# EAGLE design CC1101-1190EM_Adapter_V1_00 (EAGLE 6.4)
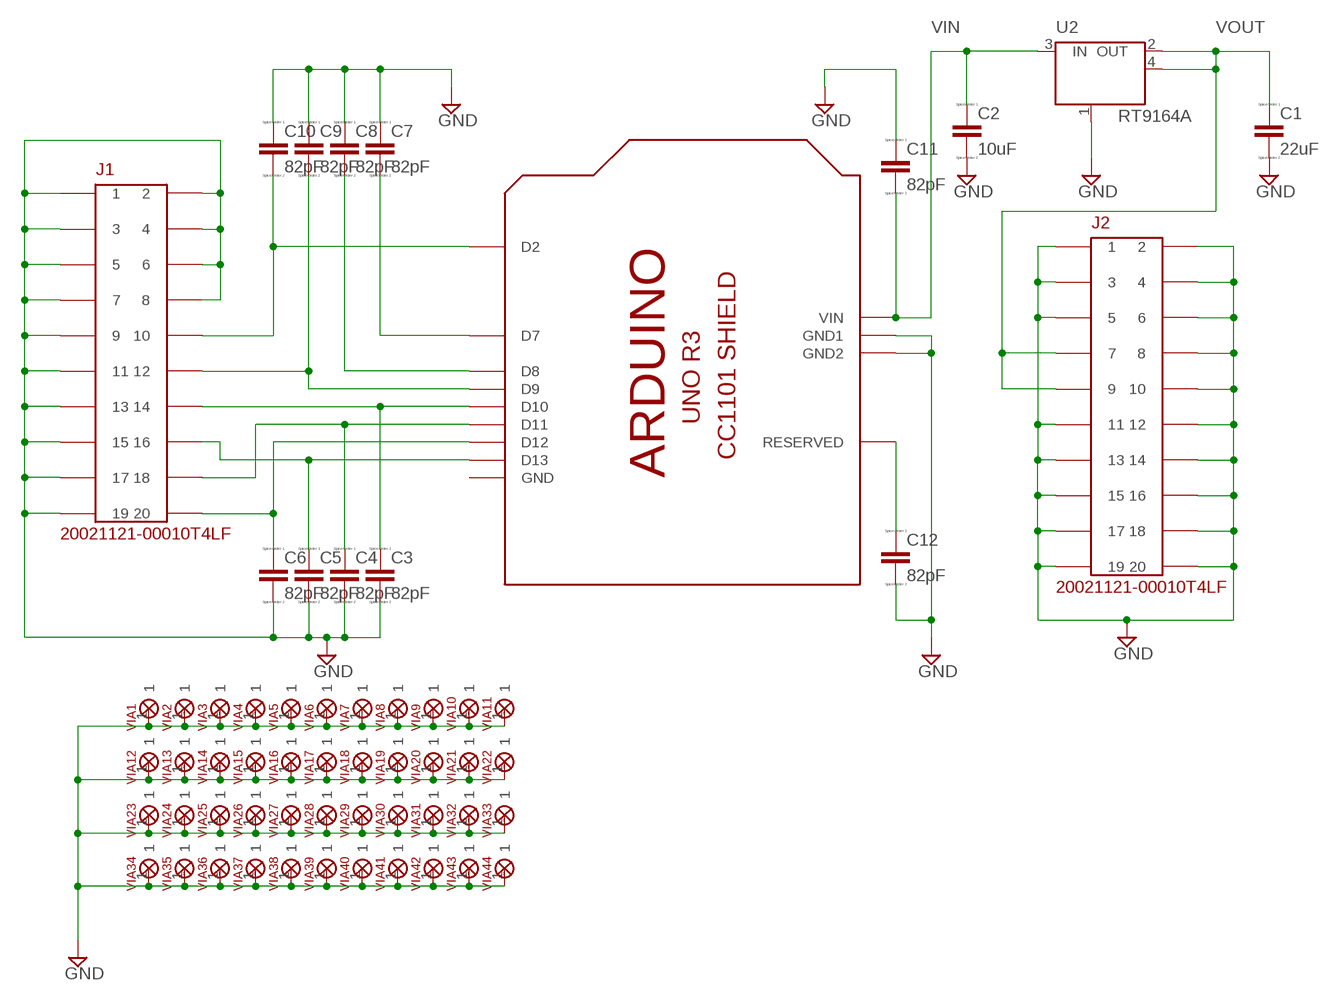
[diagram p0: schematic, sheet 1]

## Parts
C1  22uF  CC1206  [C1206]
C2  10uF  CC1206  [C1206]
C3  82pF  C  [C0805]
C4  82pF  C  [C0805]
C5  82pF  C  [C0805]
C6  82pF  C  [C0805]
C7  82pF  C  [C0805]
C8  82pF  C  [C0805]
C9  82pF  C  [C0805]
C10  82pF  C  [C0805]
C11  82pF  C  [C0805]
C12  82pF  C  [C0805]
J1  20021121-00010T4LF  [PINHDR10X2_50X50MIL_SMT]
J2  20021121-00010T4LF  [PINHDR10X2_50X50MIL_SMT]
U1  SHIELD-UNOR3-CC1101  [SHIELD-UNOR3-CC1101]
U2  RT9164A  [TO223]
VIA1  GND_VIA_NO_THERMAL  [VIA_NO_THERMAL]
VIA2  GND_VIA_NO_THERMAL  [VIA_NO_THERMAL]
VIA3  GND_VIA_NO_THERMAL  [VIA_NO_THERMAL]
VIA4  GND_VIA_NO_THERMAL  [VIA_NO_THERMAL]
VIA5  GND_VIA_NO_THERMAL  [VIA_NO_THERMAL]
VIA6  GND_VIA_NO_THERMAL  [VIA_NO_THERMAL]
VIA7  GND_VIA_NO_THERMAL  [VIA_NO_THERMAL]
VIA8  GND_VIA_NO_THERMAL  [VIA_NO_THERMAL]
VIA9  GND_VIA_NO_THERMAL  [VIA_NO_THERMAL]
VIA10  GND_VIA_NO_THERMAL  [VIA_NO_THERMAL]
VIA11  GND_VIA_NO_THERMAL  [VIA_NO_THERMAL]
VIA12  GND_VIA_NO_THERMAL  [VIA_NO_THERMAL]
VIA13  GND_VIA_NO_THERMAL  [VIA_NO_THERMAL]
VIA14  GND_VIA_NO_THERMAL  [VIA_NO_THERMAL]
VIA15  GND_VIA_NO_THERMAL  [VIA_NO_THERMAL]
VIA16  GND_VIA_NO_THERMAL  [VIA_NO_THERMAL]
VIA17  GND_VIA_NO_THERMAL  [VIA_NO_THERMAL]
VIA18  GND_VIA_NO_THERMAL  [VIA_NO_THERMAL]
VIA19  GND_VIA_NO_THERMAL  [VIA_NO_THERMAL]
VIA20  GND_VIA_NO_THERMAL  [VIA_NO_THERMAL]
VIA21  GND_VIA_NO_THERMAL  [VIA_NO_THERMAL]
VIA22  GND_VIA_NO_THERMAL  [VIA_NO_THERMAL]
VIA23  GND_VIA_NO_THERMAL  [VIA_NO_THERMAL]
VIA24  GND_VIA_NO_THERMAL  [VIA_NO_THERMAL]
VIA25  GND_VIA_NO_THERMAL  [VIA_NO_THERMAL]
VIA26  GND_VIA_NO_THERMAL  [VIA_NO_THERMAL]
VIA27  GND_VIA_NO_THERMAL  [VIA_NO_THERMAL]
VIA28  GND_VIA_NO_THERMAL  [VIA_NO_THERMAL]
VIA29  GND_VIA_NO_THERMAL  [VIA_NO_THERMAL]
VIA30  GND_VIA_NO_THERMAL  [VIA_NO_THERMAL]
VIA31  GND_VIA_NO_THERMAL  [VIA_NO_THERMAL]
VIA32  GND_VIA_NO_THERMAL  [VIA_NO_THERMAL]
VIA33  GND_VIA_NO_THERMAL  [VIA_NO_THERMAL]
VIA34  GND_VIA_NO_THERMAL  [VIA_NO_THERMAL]
VIA35  GND_VIA_NO_THERMAL  [VIA_NO_THERMAL]
VIA36  GND_VIA_NO_THERMAL  [VIA_NO_THERMAL]
VIA37  GND_VIA_NO_THERMAL  [VIA_NO_THERMAL]
VIA38  GND_VIA_NO_THERMAL  [VIA_NO_THERMAL]
VIA39  GND_VIA_NO_THERMAL  [VIA_NO_THERMAL]
VIA40  GND_VIA_NO_THERMAL  [VIA_NO_THERMAL]
VIA41  GND_VIA_NO_THERMAL  [VIA_NO_THERMAL]
VIA42  GND_VIA_NO_THERMAL  [VIA_NO_THERMAL]
VIA43  GND_VIA_NO_THERMAL  [VIA_NO_THERMAL]
VIA44  GND_VIA_NO_THERMAL  [VIA_NO_THERMAL]

## Nets
GND: C1.2 C2.2 C3.2 C4.2 C5.2 C6.2 C7.1 C8.1 C9.1 C10.1 C11.1 C12.2 J1.P$1 J1.P$2 J1.P$3 J1.P$4 J1.P$5 J1.P$6 J1.P$7 J1.P$8 J1.P$9 J1.P$11 J1.P$13 J1.P$15 J1.P$17 J1.P$19 J2.P$1 J2.P$2 J2.P$3 J2.P$4 J2.P$5 J2.P$6 J2.P$8 J2.P$10 J2.P$11 J2.P$12 J2.P$13 J2.P$14 J2.P$15 J2.P$16 J2.P$17 J2.P$18 J2.P$19 J2.P$20 U1.GND1 U1.GND2 U2.1(GND/ADJ) VIA1.1 VIA2.1 VIA3.1 VIA4.1 VIA5.1 VIA6.1 VIA7.1 VIA8.1 VIA9.1 VIA10.1 VIA11.1 VIA12.1 VIA13.1 VIA14.1 VIA15.1 VIA16.1 VIA17.1 VIA18.1 VIA19.1 VIA20.1 VIA21.1 VIA22.1 VIA23.1 VIA24.1 VIA25.1 VIA26.1 VIA27.1 VIA28.1 VIA29.1 VIA30.1 VIA31.1 VIA32.1 VIA33.1 VIA34.1 VIA35.1 VIA36.1 VIA37.1 VIA38.1 VIA39.1 VIA40.1 VIA41.1 VIA42.1 VIA43.1 VIA44.1
N$1: C3.1 J1.P$14 U1.D10
N$2: C4.1 J1.P$18 U1.D11
N$3: C6.1 J1.P$20 U1.D12
N$4: C5.1 J1.P$16 U1.D13
N$5: C10.2 J1.P$10 U1.D2
N$6: C9.2 J1.P$12 U1.D9
N$8: C8.2 U1.D8
N$9: C7.2 U1.D7
N$10: C12.1 U1.RESERVED
VIN: C2.1 C11.2 U1.VIN U2.3(IN)
VOUT: C1.1 J2.P$7 J2.P$9 U2.2(OUT) U2.4(OUT)

## Power pins joined to a net without a drawn wire
GND: U1.GND

## Library data of the parts
C1-C12 = eagle-ltspice:C: CAPACITOR, European symbol; SPICEMODEL: NONE; SPICEPREFIX: C
J1 J2 = fhpower:20021121-00010T4LF: 2x10 50mil Male Pin Header Unshrouded
U1 = adafruit-fh:SHIELD-UNOR3-CC1101
U2 = fhpower:RT9164A
VIA1-VIA44 = fhmechanical:GND_VIA_NO_THERMAL

## Board
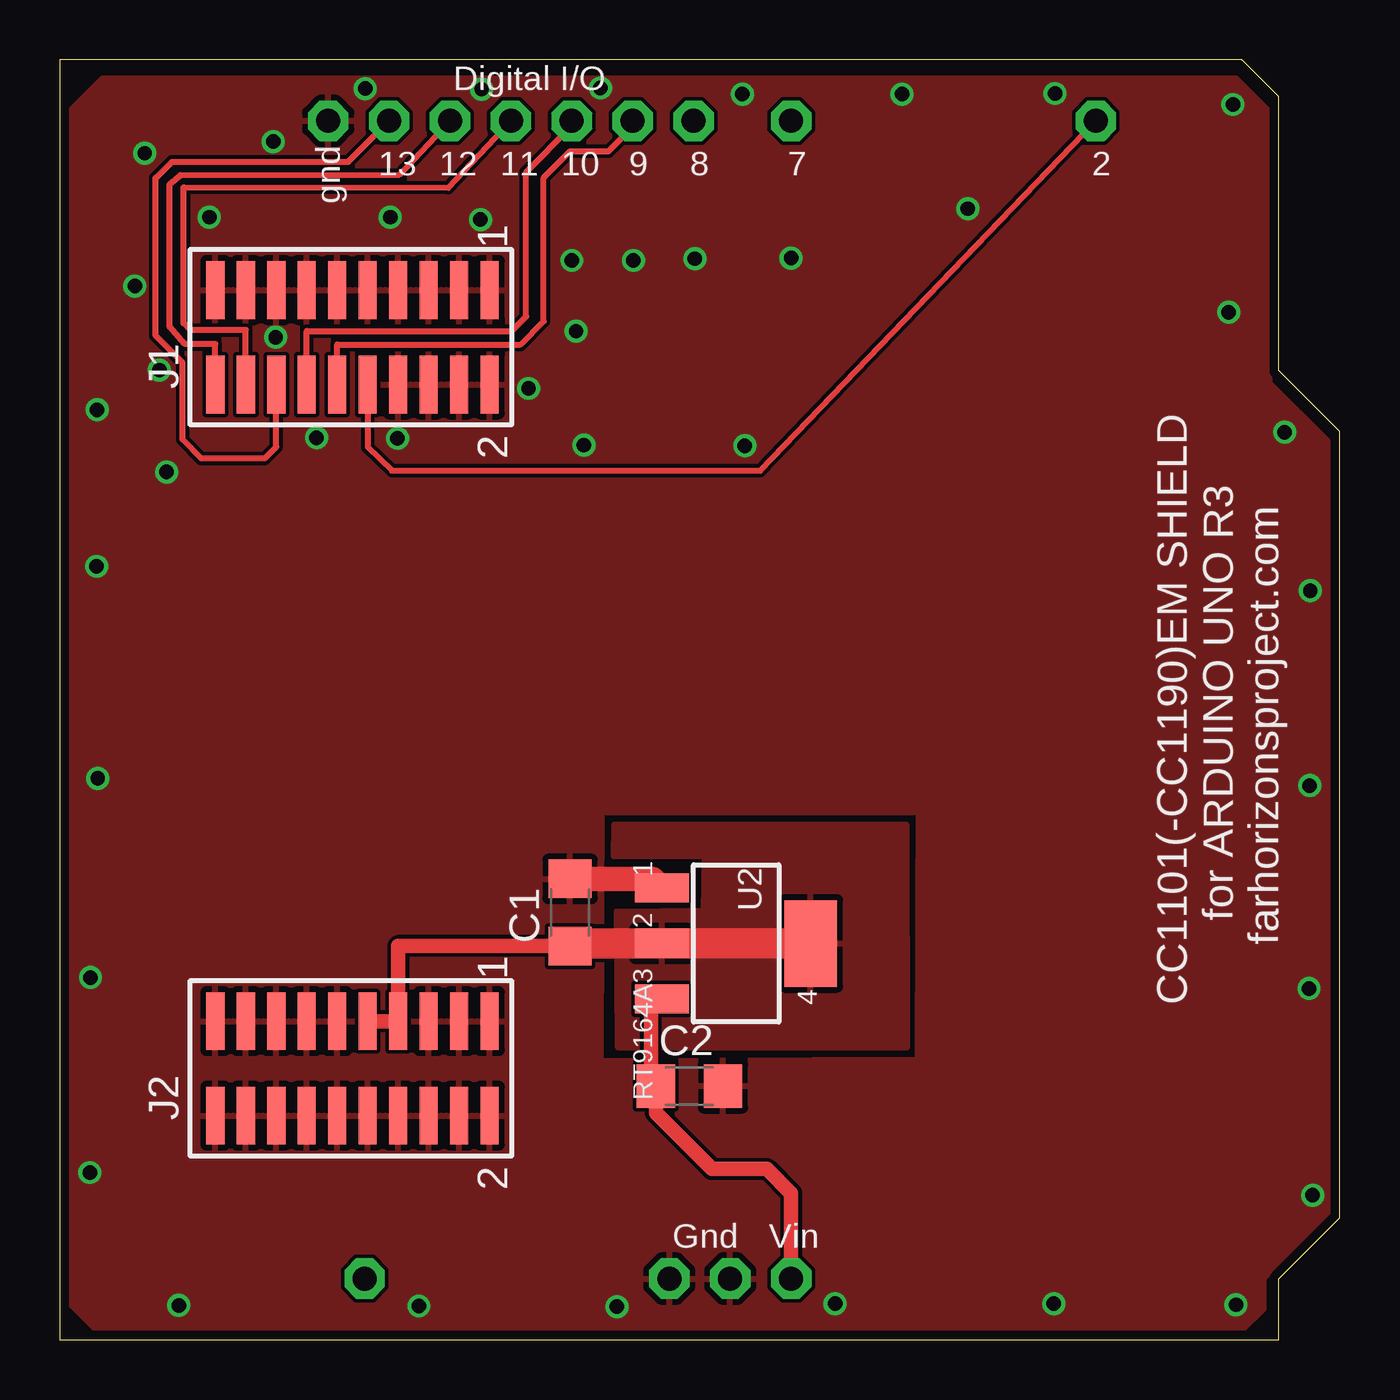
[diagram p1: board, top side]
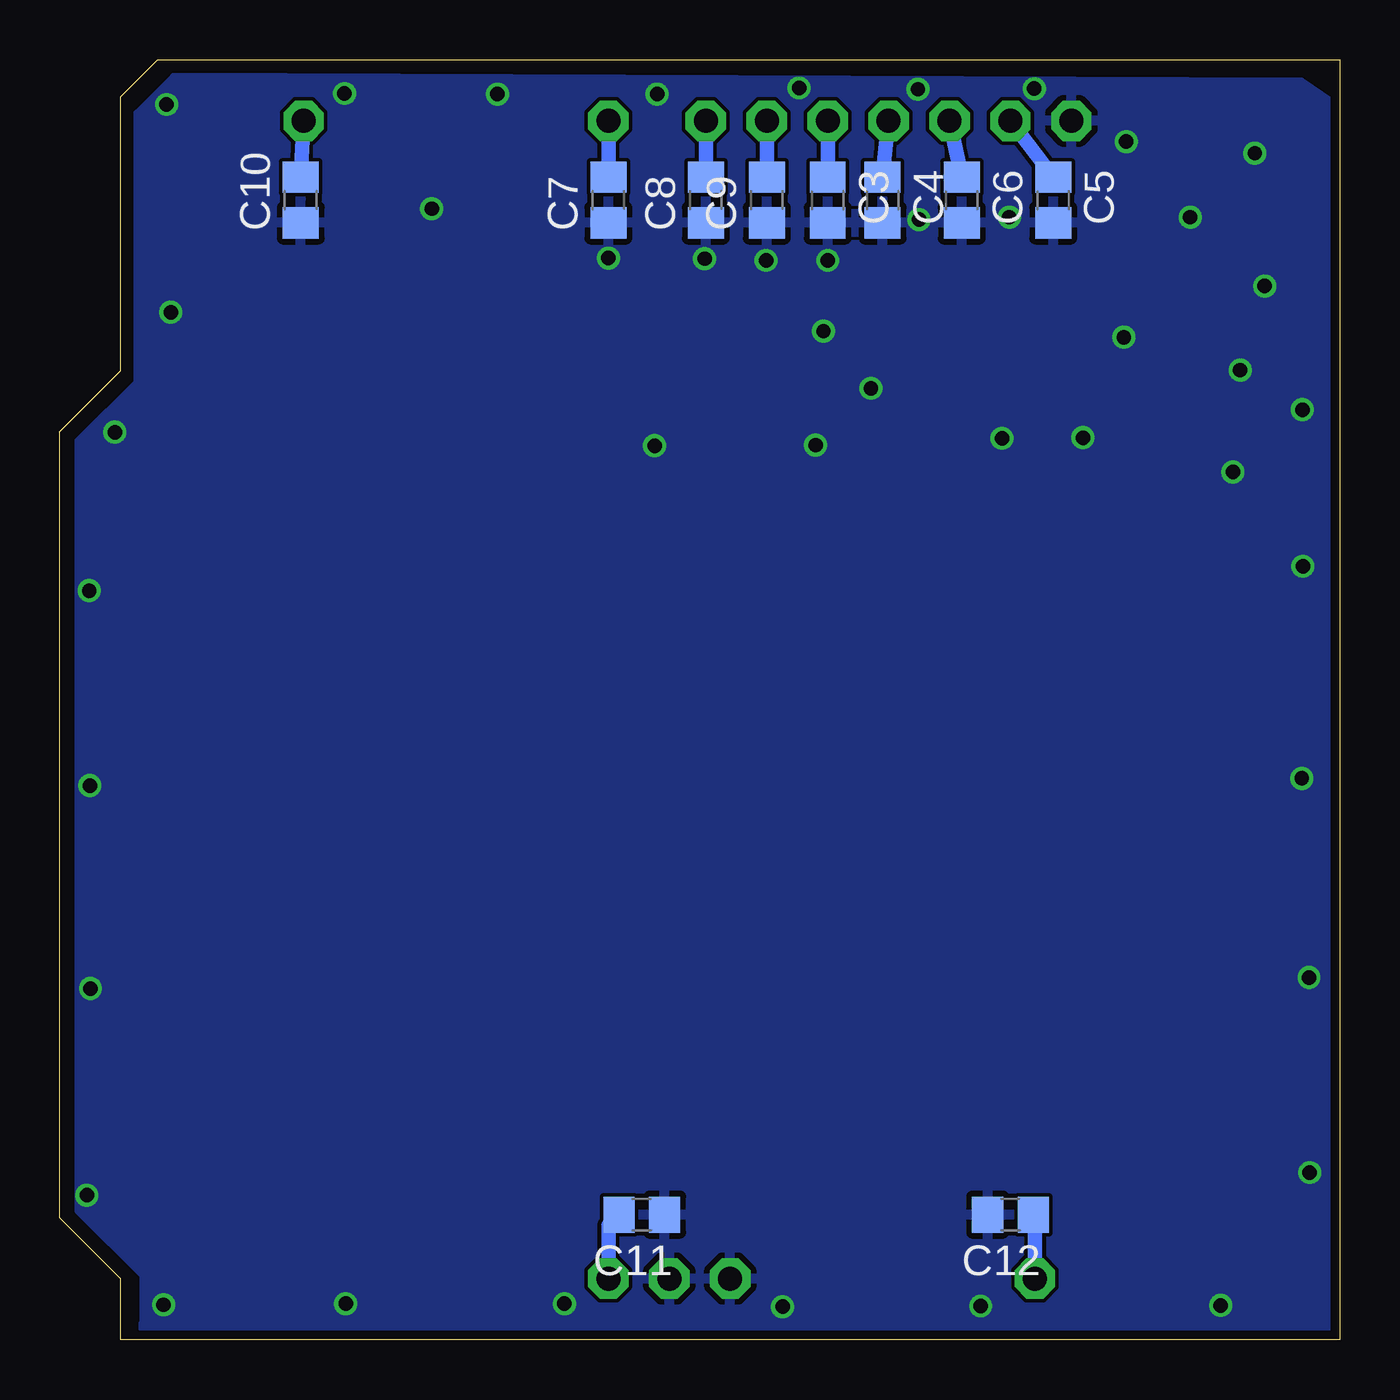
[diagram p2: board, bottom side, seen from below]

Size 53.34 x 53.34 mm. Coordinates in mm from the lower left corner, seen from the top.
Copper layers (1*16): Top 0.0356mm / dielectric 1.5011mm / Bottom 0.0356mm
Design rules "LaenPCBOrder": minimum track width 6mil, minimum drill 13mil, track to track 6mil, track to pad 6mil, pad to pad 6mil, via to via 6mil, smd to smd 6mil, copper to edge 15mil, drill to drill 6mil, minimum pad ring 7mil, minimum via ring 7mil, stop-mask expansion 4mil, vias tented up to drill 0mil, thermal gap 10mil

### Footprints (pad centres in the part's own frame; a part is rotated, then mirrored left to right if it is on the bottom)
C1206 = smd 1.6 x 1.8: 1 -1.4,0; 2 1.4,0
C0805 = smd 1.3 x 1.5: 1 -0.95,0; 2 0.95,0
PINHDR10X2_50X50MIL_SMT = smd 2.413 x 0.762: P$1 -1.968,5.715; P$2 1.968,5.715; P$3 -1.968,4.445; P$4 1.968,4.445; P$5 -1.968,3.175; P$6 1.968,3.175; P$7 -1.968,1.905; P$8 1.968,1.905; P$9 -1.968,0.635; P$10 1.968,0.635; P$11 -1.968,-0.635; P$12 1.968,-0.635; P$13 -1.968,-1.905; P$14 1.968,-1.905; P$15 -1.968,-3.175; P$16 1.968,-3.175; P$17 -1.968,-4.445; P$18 1.968,-4.445; P$19 -1.968,-5.715; P$20 1.968,-5.715
SHIELD-UNOR3-CC1101 = drill 1 pad 1.676 octagon: D2 43.18,50.8; D7 30.48,50.8; D8 26.416,50.8; D9 23.876,50.8; D10 21.336,50.8; D11 18.796,50.8; D12 16.256,50.8; D13 13.716,50.8; GND 11.176,50.8; GND1 27.94,2.54; GND2 25.4,2.54; RESERVED 12.7,2.54; VIN 30.48,2.54
TO223 = smd 1.219 x 2.235: 1 -2.311,-3.099; 2 0,-3.099; 3 2.311,-3.099 | smd 3.6 x 2.2: 4 0,3.099
VIA_NO_THERMAL = drill 0.6: 1 0,0

### Placement (x,y rotation side)
C1  21.26,17.81 90 top
C2  26.24,10.57 0 top
C3  21.34,47.5 270 bottom
C4  19.05,47.5 270 bottom
C5  11.94,47.5 270 bottom
C6  15.75,47.5 270 bottom
C7  30.48,47.5 90 bottom
C8  26.42,47.5 90 bottom
C9  23.88,47.5 90 bottom
C10  43.31,47.5 90 bottom
C11  29.08,5.21 180 bottom
C12  13.72,5.21 180 bottom
J1  12.19,41.78 270 top
J2  12.19,11.3 270 top
U1  0,0 0 top
U2  28.19,16.51 270 top
VIA1  4.14,40.41 0 top
VIA2  3.12,43.92 0 top
VIA3  3.53,49.45 0 top
VIA4  8.89,49.94 0 top
VIA5  12.73,52.15 0 top
VIA6  17.58,52.12 0 top
VIA7  22.53,52.17 0 top
VIA8  6.22,46.79 0 top
VIA9  13.77,46.79 0 top
VIA10  17.53,46.69 0 top
VIA11  21.34,44.98 0 top
VIA12  23.9,44.98 0 top
VIA13  26.47,45.06 0 top
VIA14  30.48,45.09 0 top
VIA15  28.45,51.92 0 top
VIA16  35.1,51.92 0 top
VIA17  41.48,51.94 0 top
VIA18  48.9,51.49 0 top
VIA19  48.72,42.82 0 top
VIA20  51.05,37.82 0 top
VIA21  52.12,31.22 0 top
VIA22  52.1,23.09 0 top
VIA23  52.07,14.63 0 top
VIA24  4.45,36.17 0 top
VIA25  14.07,37.57 0 top
VIA26  37.85,47.14 0 top
VIA27  52.22,6.02 0 top
VIA28  8.99,41.78 0 top
VIA29  19.53,39.65 0 top
VIA30  21.51,42.04 0 top
VIA31  49.02,1.45 0 top
VIA32  10.69,37.59 0 top
VIA33  21.84,37.29 0 top
VIA34  28.55,37.26 0 top
VIA35  41.43,1.5 0 top
VIA36  1.57,23.39 0 top
VIA37  1.52,32.23 0 top
VIA38  1.55,38.76 0 top
VIA39  32.31,1.5 0 top
VIA40  4.95,1.42 0 top
VIA41  1.24,6.96 0 top
VIA42  1.27,15.09 0 top
VIA43  23.22,1.37 0 top
VIA44  14.96,1.4 0 top

### Tracks (layer width: path | path; a pad name or v marks a point on that pad's centre or on a via)
GND
  Top 0.254: 21.26,18.82 C1.2
  Top 1.016: U2.1 24.71,19.2 C1.2
  pour Bottom: 0.41,51.59 1.6,52.4 48.56,52.6 50.09,51.08 50.09,39.88 52.53,37.44 52.53,5.38 49.83,2.69 49.83,0.66 49.94,0.56 0.53,0.41
  pour Top: 22.53,11.61 35.76,11.68 35.81,22.86 52.83,22.86 52.83,5.21 50.16,2.54 50.16,1.27 49.28,0.38 1.52,0.38 0.51,1.4 0.51,22.86 22.58,22.78
  pour Top: 1.78,52.58 49.02,52.58 50.42,51.18 50.42,39.88 52.83,37.47 52.83,21.97 0.51,21.97 0.51,51.31
N$1
  Top 0.254: U1.D10 21.34,50.57 19.43,48.67 19.43,42.65 18.82,42.04 10.29,42.04 J1.P$14
  Bottom 0.61: C3.1 U1.D10
N$2
  Top 0.254: U1.D11 16.18,48.01 5.18,48.03 5.16,48.03 5.16,42.37 5.44,42.09 7.75,42.09 J1.P$18
  Bottom 0.61: C4.1 U1.D11
N$3
  Top 0.254: U1.D12 14.15,48.56 5.03,48.54 4.57,48.16 4.57,42.22 5.21,41.5 6.48,41.5 J1.P$20
  Bottom 0.61: C6.1 U1.D12
N$4
  Top 0.254: U1.D13 12.01,49.1 4.67,49.1 3.99,48.41 3.99,41.86 5.11,40.72 5.11,37.52 5.89,36.73 8.53,36.73 9.02,37.21 J1.P$16
  Bottom 0.61: C5.1 U1.D13
N$5
  Top 0.254: U1.D2 29.18,36.22 13.84,36.22 12.83,37.21 J1.P$10
  Bottom 0.61: C10.2 U1.D2
N$6
  Top 0.254: U1.D9 23.88,50.55 22.86,49.53 21.26,49.53 20.17,48.44 20.17,42.44 19.2,41.48 11.56,41.48 J1.P$12
  Bottom 0.61: C9.2 U1.D9
N$8
  Bottom 0.61: C8.2 U1.D8
N$9
  Bottom 0.61: C7.2 U1.D7
N$10
  Bottom 0.61: C12.1 12.7,5.14 U1.RESERVED
VIN
  Top 0.61: U2.3 24.64,13.97 24.64,11.07 C2.1 24.84,9.45 27.18,7.11 29.46,7.11 30.48,6.1 U1.VIN
  Bottom 0.61: U1.VIN 30.48,4.76 C11.2
VOUT
  Top 0.254: 21.14,16.41 C1.1
  Top 0.61: C1.1 14.1,16.41 J2.P$7 J2.P$9
  Top 1.27: 21.21,16.48 C1.1 21.24,16.51 U2.2 U2.4
  pour Top: 35.31,12.17 23.27,12.17 23.22,17.86 26.85,17.88 26.9,20.14 23.09,20.14 23.11,21.46 35.28,21.46